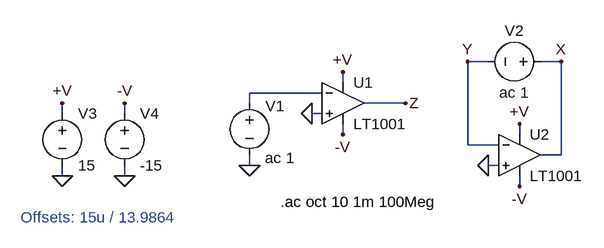
[diagram p0: schematic Loop2.asc]
Loop2.asc, the LTspice schematic file:
Version 4
SHEET 1 1180 680
WIRE 128 272 128 256
WIRE 128 368 128 352
WIRE 224 272 224 256
WIRE 224 368 224 352
WIRE 416 256 416 240
WIRE 416 352 416 336
WIRE 528 240 416 240
WIRE 528 272 512 272
WIRE 560 224 560 208
WIRE 560 304 560 288
WIRE 656 256 592 256
WIRE 752 320 752 192
WIRE 784 192 752 192
WIRE 800 320 752 320
WIRE 800 352 784 352
WIRE 832 304 832 288
WIRE 832 384 832 368
WIRE 896 192 864 192
WIRE 896 336 864 336
WIRE 896 336 896 192
FLAG 416 352 0
FLAG 896 192 X
FLAG 752 192 Y
FLAG 656 256 Z
FLAG 560 208 +V
FLAG 560 304 -V
FLAG 512 272 0
FLAG 224 368 0
FLAG 128 368 0
FLAG 128 256 +V
FLAG 224 256 -V
FLAG 832 288 +V
FLAG 832 384 -V
FLAG 784 352 0
SYMBOL voltage 416 240 R0
WINDOW 0 25 20 Left 0
WINDOW 3 24 100 Left 0
SYMATTR InstName V1
SYMATTR Value ac 1
SYMBOL voltage 880 192 R90
WINDOW 0 -32 56 VBottom 0
WINDOW 3 32 56 VTop 0
SYMATTR InstName V2
SYMATTR Value ac 1
SYMBOL opamps\\LT1001 560 192 R0
SYMATTR InstName U1
SYMBOL voltage 128 256 R0
SYMATTR InstName V3
SYMATTR Value 15
SYMBOL voltage 224 256 R0
SYMATTR InstName V4
SYMATTR Value -15
SYMBOL opamps\\LT1001 832 272 R0
SYMATTR InstName U2
TEXT 464 408 Left 0 !.ac oct 10 1m 100Meg
TEXT 64 432 Left 0 ;Offsets: 15u / 13.9864

The netlist it stands for:
* Loop2.asc
V1 N001 0 ac 1
V2 X Y ac 1
XU1 0 N001 +V -V Z LT1001  ; pins In+ In- V+ V- OUT
V3 +V 0 15
V4 -V 0 -15
XU2 0 Y +V -V X LT1001  ; pins In+ In- V+ V- OUT
.ac oct 10 1m 100Meg
* Offsets: 15u / 13.9864
.lib LTC.lib
.backanno
.end